# Altium project MicroCO2Sensor.PrjPcb
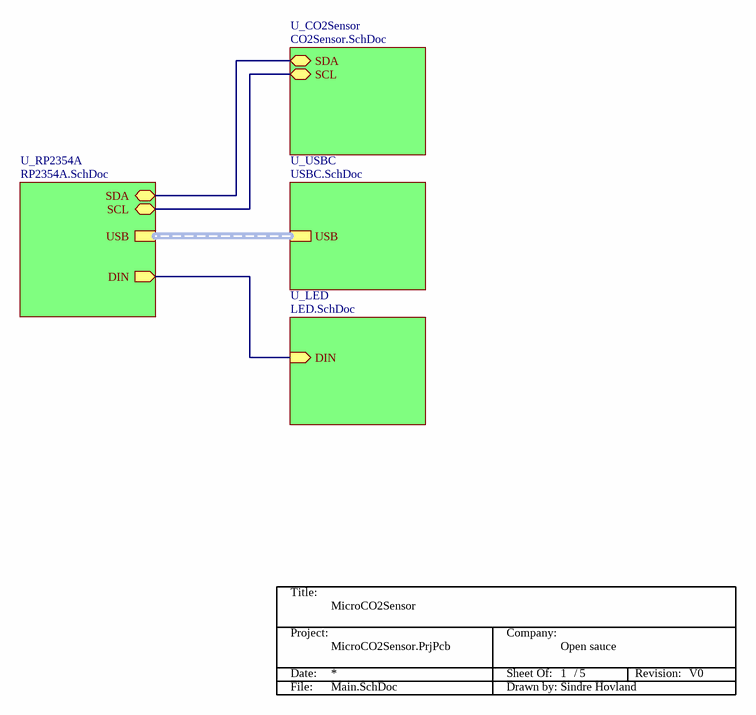
[diagram p0: Main.SchDoc]
5 sheets, 50 parts. Net scope: hierarchical (ports join the sheet entries above them; power ports are global).
Board file: PCB.PcbDoc
Sheets:
  Main.SchDoc
    U_CO2Sensor = CO2Sensor.SchDoc
    U_USBC = USBC.SchDoc
    U_LED = LED.SchDoc
    U_RP2354A = RP2354A.SchDoc

## Sheet Main.SchDoc: MicroCO2Sensor
size A; DrawnBy: Sindre Hovland; Organization: Open sauce; Revision: V0; SheetNumber: 1; SheetTotal: 5

### Parts
*  TitleBlock  (value not drawn)  (graphical)

### Sub-sheets
U_CO2Sensor = CO2Sensor.SchDoc: SDA (bidir), SCL (bidir)
U_LED = LED.SchDoc: DIN (in)
U_RP2354A = RP2354A.SchDoc: USB, DIN (out), SCL (bidir), SDA (bidir)
U_USBC = USBC.SchDoc: USB (harness USB)

### Nets
NetR2_1: sheet U_CO2Sensor/SCL, sheet U_RP2354A/SCL
NetR4_1: sheet U_CO2Sensor/SDA, sheet U_RP2354A/SDA
NetR6_2: sheet U_LED/DIN, sheet U_RP2354A/DIN

### Buses and harness runs
harness sheet U_RP2354A/USB = sheet U_USBC/USB

### Notes on the sheet
- (in symbol TitleBlock) Title:; Project:; Company:; Date:; Sheet Of:; /; Revision:; File:; Drawn by:

## Sheet CO2Sensor.SchDoc: CO2 Sensor
size A; DrawnBy: Sindre Hovland; Organization: Open sauce; Revision: V0; SheetNumber: 2; SheetTotal: 5
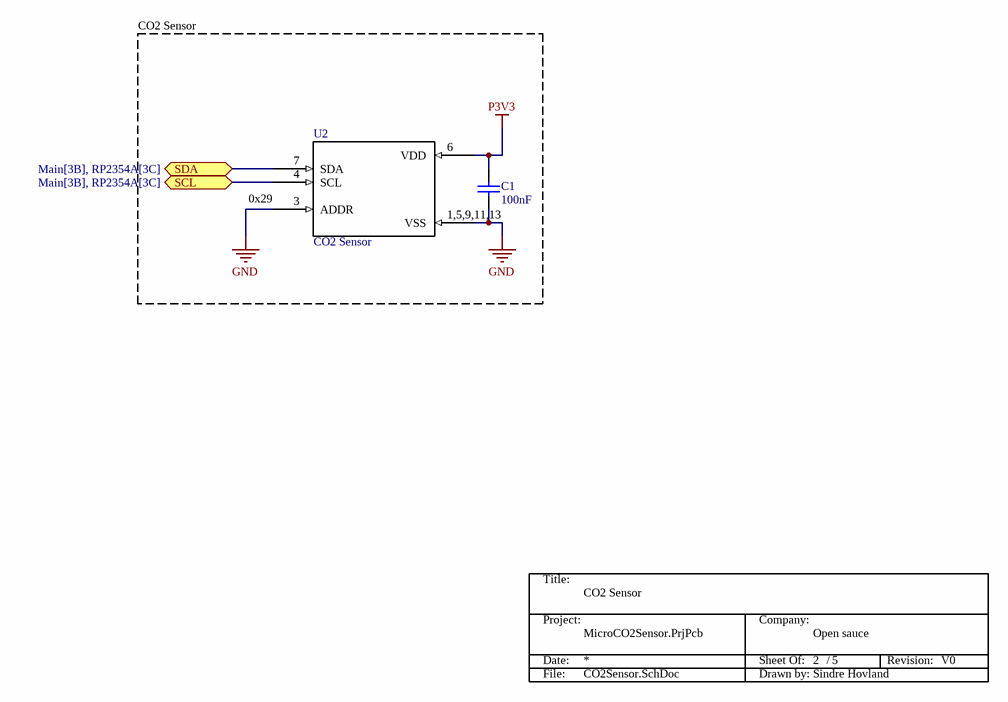
[diagram p1: CO2Sensor.SchDoc]

### Parts
(Parts that share a designator on the sheet are numbered #1, #2 ... from top to bottom, then left to right.)
*?#1  TitleBlock  (value not drawn)  (graphical)
C1  100nF  [C0201]
U2  CO2 Sensor  [STC31-C]

### Ports
SCL (bidir, see Main[3B], RP2354A[3C]), SDA (bidir, see Main[3B], RP2354A[3C])

### Nets
GND: C1.1 U2.1,5,9,11,13(VSS) U2.3(ADDR)
P3V3: C1.2 U2.6(VDD)
NetR2_1: U2.4(SCL) ; port SCL
NetR4_1: U2.7(SDA) ; port SDA

### Notes on the sheet
- CO2 Sensor
- (near U2) 0x29
- (in symbol TitleBlock) Title:; Project:; Company:; Date:; Sheet Of:; /; Revision:; File:; Drawn by:

### Library data of the parts
C1 = CAP: Capacitor; Value: 100pF; Published: 8-Jun-2000; Revision: July-2002: Re-released for DXP Platform.; Publisher: Altium Limited
U2 = STC31-C: CO₂ accuracy of ±(0.2 - 2.0 vol%) @0-100 vol%

## Sheet USBC.SchDoc: USBC/Power
size A; DrawnBy: Sindre Hovland; Organization: Open sauce; Revision: V0; SheetNumber: 3; SheetTotal: 5
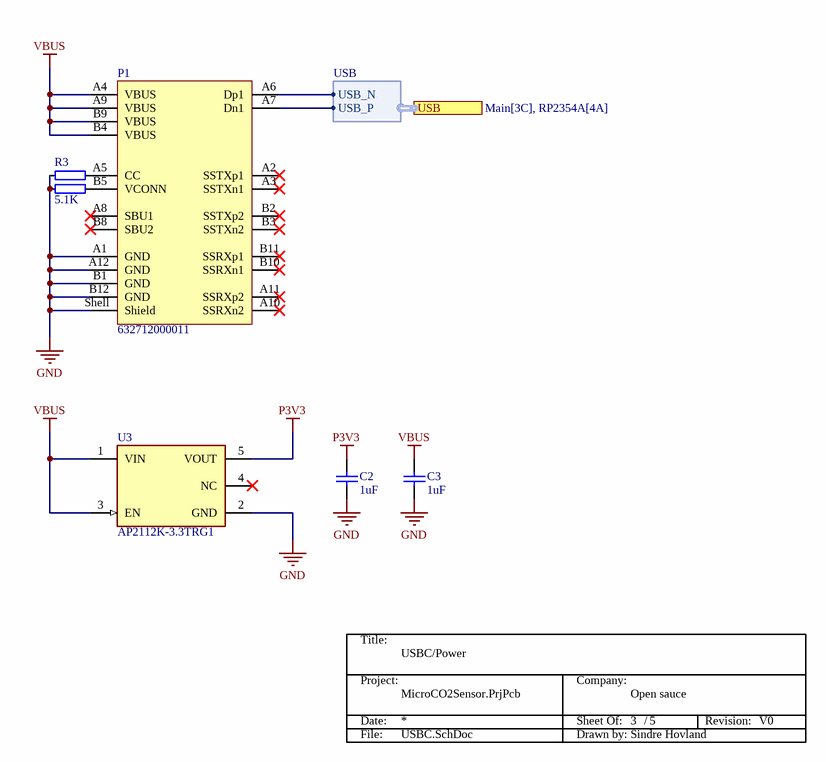
[diagram p2: USBC.SchDoc]

### Parts
(Parts that share a designator on the sheet are numbered #1, #2 ... from top to bottom, then left to right.)
*?#2  TitleBlock  (value not drawn)  (graphical)
C2  1uF  [C0402]
C3  1uF  [C0402]
P1  632712000011  [632712000011]
R3  5.1K  [R0201]  (value not drawn)
R7  5.1K  [R0201]
U3  AP2112K-3.3TRG1  [FP-SOT25-IPC_C]

### Ports
USB (harness USB, see Main[3C], RP2354A[4A])

### Harnesses
USB: USB_N, USB_P

### Nets
GND: C2.1 C3.1 P1.A1(GND) P1.A12(GND) P1.B1(GND) P1.B12(GND) P1.Shell(Shield) R3.2 R7.2 U3.2(GND)
P3V3: C2.2 U3.5(VOUT)
VBUS: C3.2 P1.A4(VBUS) P1.A9(VBUS) P1.B4(VBUS) P1.B9(VBUS) U3.1(VIN) U3.3(EN)
USB_N: P1.A6(Dp1) ; port USB.USB_N
USB_P: P1.A7(Dn1) ; port USB.USB_P
NetP1_A5: P1.A5(CC) R3.1
NetP1_B5: P1.B5(VCONN) R7.1

Not connected (* = marked no-connect by the designer): P1 A2(SSTXp1)* A3(SSTXn1)* A8(SBU1)* A10(SSRXn2)* A11(SSRXp2)* B2(SSTXp2)* B3(SSTXn2)* B8(SBU2)* B10(SSRXn1)* B11(SSRXp1)*; U3 4(NC)*

### Notes on the sheet
- (in symbol TitleBlock) Title:; Project:; Company:; Date:; Sheet Of:; /; Revision:; File:; Drawn by:

### Library data of the parts
C2 C3 = CAP: Capacitor; Value: 100pF; Published: 8-Jun-2000; Revision: July-2002: Re-released for DXP Platform.; Publisher: Altium Limited
P1 = CMP-1502-03215-3: NexarPartId: 68112673; Voltage Rating: 20V; Connector Type: USB; Contact Resistance: 30mΩ; USB Standard: USB 3.1; Number of Contacts: 22; Insulation Resistance: 1GΩ; Current Rating: 5A; Number of Pins: 22; Orientation: Horizontal; Height: 1.9mm; RoHS: Compliant; Contact Material: Gold, Nickel; Min Operating Temperature: -25°C; Packaging: Tape and Reel; Mount: Horizontal, Surface Mount; Max Operating Temperature: 105°C
R3 R7 = RES: Resistor, Generic; Part Number: R0201-0R; Part number IPS: 00000003245; Value: 0R; Note: Chip Res 5%; Artikkelnr Noca: N.A.; Manufacturer: *; Manufacturer Part Number: *; ComponentLink1URL: *; ComponentLink1Description: Datasheet; ComponentLink2URL: *; ComponentLink2Description: Supplier link; HelpURL: *; Footprint Doc: 0201; LatestRevisionDate: 2017-11-09; Pin Count: 2; Publisher: Nordic Semiconductor; Published: 2014-11-13; Supplier 1: *; Supplier Part Number 1: *; Supplier 2: *; Supplier Part Number 2: *
U3 = CMP-12756-000035-1: IC REG LINEAR 3.3V 600MA SOT25; Number of Regulators: 1; Output Type: Fixed; Polarity: Positive; Min Input Voltage: 2.5V; Max Input Voltage: 6V; Accuracy: 1.5%; Quiescent Current: 55uA; Dropout Voltage: 250mV; Min Operating Temperature: -40°C; Length: 3.1mm; Output Current: 600mA; Max Operating Temperature: 85°C; Package Quantity: 1; Output Voltage: 3.3V; Width: 1.7mm; Number of Outputs: 1; Packaging: Tape and Reel; Height: 1.3mm; Lead Free: Lead Free; Max Output Current: 600mA; Case/Package: SOT-23-5; Mount: Surface Mount; Number of Pins: 5

## Sheet LED.SchDoc: Neopixel
size A; DrawnBy: Sindre Hovland; Organization: Open sauce; Revision: V0; SheetNumber: 5; SheetTotal: 5
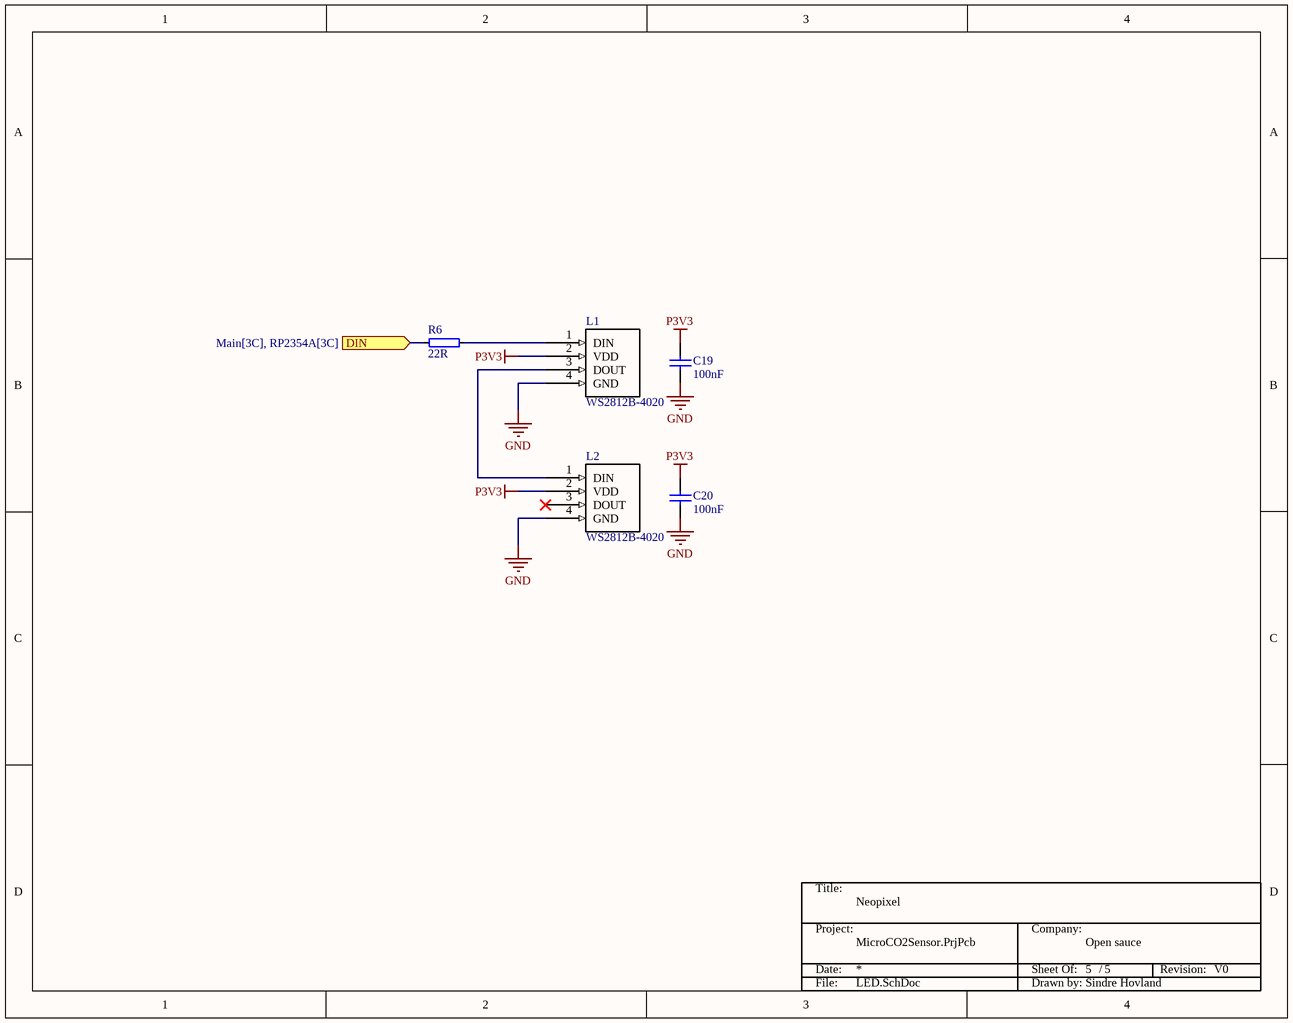
[diagram p3: LED.SchDoc]

### Parts
(Parts that share a designator on the sheet are numbered #1, #2 ... from top to bottom, then left to right.)
*?#3  TitleBlock  (value not drawn)  (graphical)
C19  100nF  [C0201]
C20  100nF  [C0201]
L1  WS2812B-4020  [WS2812B-4020-Footprint-1]
L2  WS2812B-4020  [WS2812B-4020-Footprint-1]
R6  22R  [R0201]

### Ports
DIN (in, see Main[3C], RP2354A[3C])

### Nets
GND: C19.1 C20.1 L1.4(GND) L2.4(GND)
P3V3: C19.2 C20.2 L1.2(VDD) L2.2(VDD)
NetL1_1: L1.1(DIN) R6.1
NetL1_3: L1.3(DOUT) L2.1(DIN)
NetR6_2: R6.2 ; port DIN

Not connected (* = marked no-connect by the designer): L2 3(DOUT)*

### Notes on the sheet
- (in symbol TitleBlock) Title:; Project:; Company:; Date:; Sheet Of:; /; Revision:; File:; Drawn by:

### Library data of the parts
C19 C20 = CAP: Capacitor; Value: 100pF; Published: 8-Jun-2000; Revision: July-2002: Re-released for DXP Platform.; Publisher: Altium Limited
L1 L2 = WS2812B-4020: WS2812B based adressable led 90 deg 0402 mini; ComponentLink2URL: https://datasheet.lcsc.com/lcsc/2012110135_Worldsemi-WS2812B-4020_C965557.pdf; ComponentLink2Description: Datasheet; MPN: WS2812B-4020; ComponentLink1Description: China; ComponentLink1URL: https://www.youtube.com/watch?v=W8x4m-qpmJ8
R6 = RES: as R3 on sheet USBC; Manufacturer: *; Manufacturer Part Number: *; ComponentLink1URL: *; ComponentLink1Description: Datasheet; ComponentLink2URL: *; ComponentLink2Description: Supplier link; HelpURL: *; Footprint Doc: 0201; LatestRevisionDate: 2017-11-09; Pin Count: 2; Publisher: Nordic Semiconductor; Published: 2014-11-13; Supplier 1: *; Supplier Part Number 1: *; Supplier 2: *; Supplier Part Number 2: *

## Sheet RP2354A.SchDoc: MCU
size A; DrawnBy: Sindre Hovland; Organization: Open sauce; Revision: V0; SheetNumber: 4; SheetTotal: 5
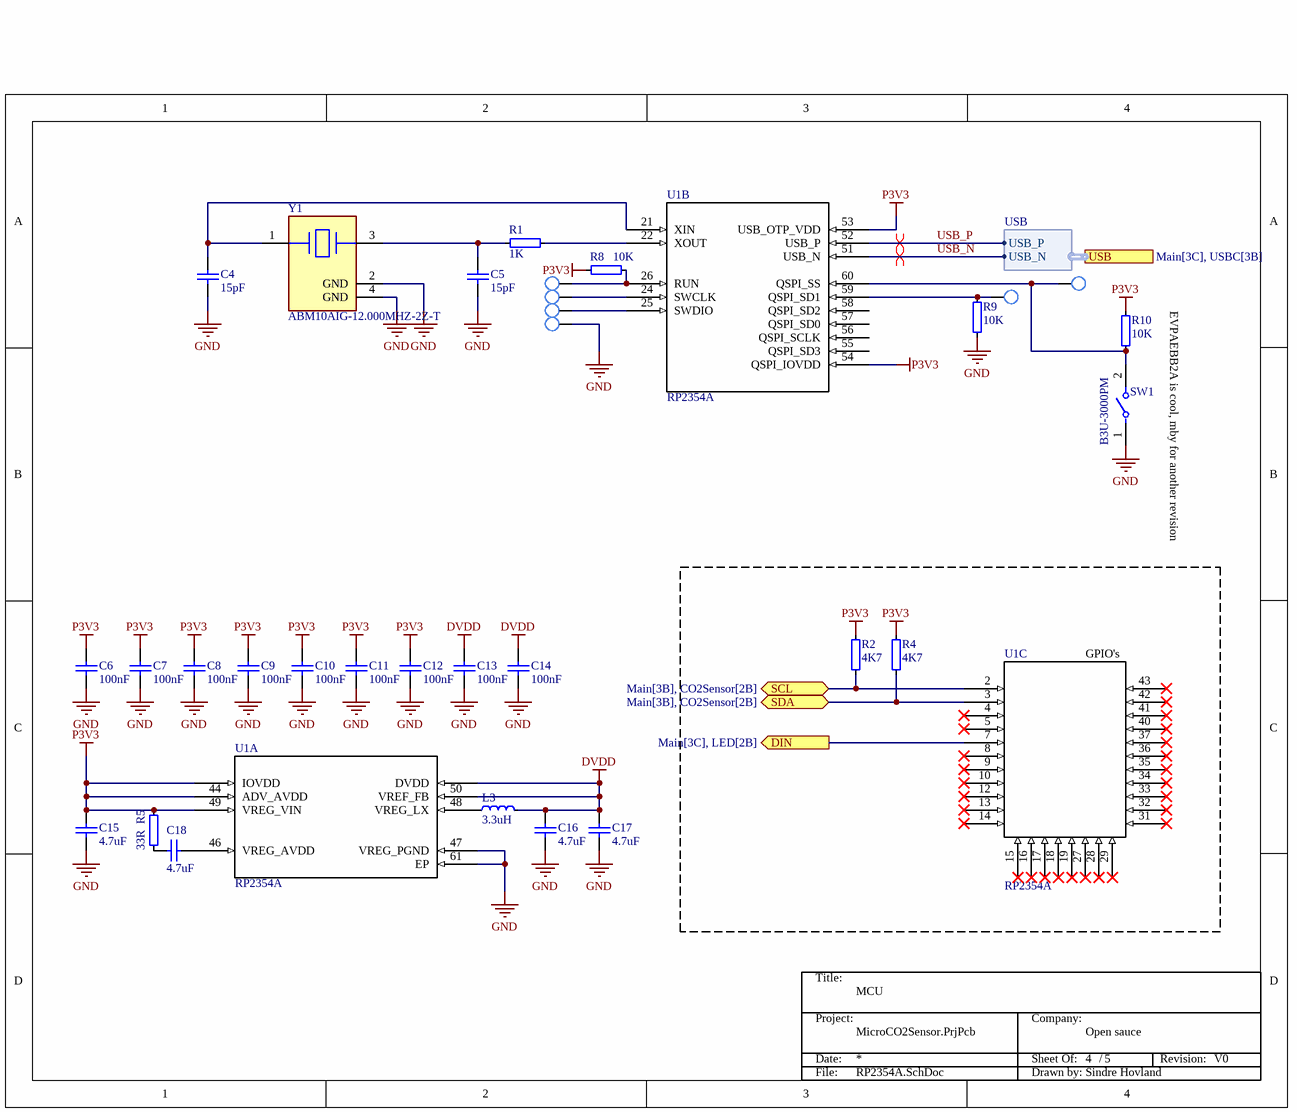
[diagram p4: RP2354A.SchDoc]

### Parts
(Parts that share a designator on the sheet are numbered #1, #2 ... from top to bottom, then left to right.)
*?#4  TitleBlock  (value not drawn)  (graphical)
C4  15pF  [C0201]
C5  15pF  [C0201]
C6  100nF  [C0201]
C7  100nF  [C0201]
C8  100nF  [C0201]
C9  100nF  [C0201]
C10  100nF  [C0201]
C11  100nF  [C0201]
C12  100nF  [C0201]
C13  100nF  [C0201]
C14  100nF  [C0201]
C15  4.7uF  [C0402]
C16  4.7uF  [C0402]
C17  4.7uF  [C0402]
C18  4.7uF  [C0402]
GND  DNP  [TP_SMD_1.0mm]  (value not drawn)
L3  3.3uH  [IND0805]
R1  1K  [R0201]
R2  4K7  [R0201]
R4  4K7  [R0201]
R5  33R  [RES0402]
R8  10K  [R0201]
R9  10K  [R0201]
R10  10K  [R0201]
RUN  DNP  [TP_SMD_1.0mm]  (value not drawn)
SD1  DNP  [TP_SMD_1.0mm]  (value not drawn)
SS  DNP  [TP_SMD_1.0mm]  (value not drawn)
SW1  B3U-3000PM  [FP-B3U-3000PM-MFG]
SWCLK  DNP  [TP_SMD_1.0mm]  (value not drawn)
SWDIO  DNP  [TP_SMD_1.0mm]  (value not drawn)
U1  RP2354A  [RP2354A]  (parts A,B,C of 3)
Y1  ABM10AIG-12.000MHZ-2Z-T  [FP-ABM10AIG-MFG]

### Ports
DIN (out, see Main[3C], LED[2B]), SCL (bidir, see Main[3B], CO2Sensor[2B]), SDA (bidir, see Main[3B], CO2Sensor[2B]), USB (harness USB, see Main[3C], USBC[3B])

### Harnesses
USB: USB_N, USB_P

### Nets
DVDD: C13.1 C14.1 C16.2 C17.2 L3.2 U1.6,23,39(DVDD) U1.50(VREF_FB)
GND: C4.2 C5.1 C6.2 C7.2 C8.2 C9.2 C10.2 C11.2 C12.2 C13.2 C14.2 C15.1 C16.1 C17.1 GND.1 R9.2 SW1.1 U1.47(VREG_PGND) U1.61(EP) Y1.2(GND) Y1.4(GND)
P3V3: C6.1 C7.1 C8.1 C9.1 C10.1 C11.1 C12.1 C15.2 R2.2 R4.2 R5.2 R8.1 R10.1 U1.1,11,30,38,45,20(IOVDD) U1.44(ADV_AVDD) U1.49(VREG_VIN) U1.53(USB_OTP_VDD) U1.54(QSPI_IOVDD)
USB_N: U1.51(USB_N) ; port USB.USB_N
USB_P: U1.52(USB_P) ; port USB.USB_P
NetC4_1: C4.1 U1.21(XIN) Y1.1(1_Crystal)
NetC5_2: C5.2 R1.2 Y1.3(2_Crystal)
NetC18_1: C18.1 R5.1
NetC18_2: C18.2 U1.46(VREG_AVDD)
NetL3_1: L3.1 U1.48(VREG_LX)
NetR1_1: R1.1 U1.22(XOUT)
NetR2_1: R2.1 U1.2 ; port SCL
NetR4_1: R4.1 U1.3 ; port SDA
NetR6_2: U1.7 ; port DIN
NetR8_2: R8.2 RUN.1 U1.26(RUN)
NetR9_1: R9.1 SD1.1 U1.59(QSPI_SD1)
NetR10_2: R10.2 SS.1 SW1.2 U1.60(QSPI_SS)
NetSWCLK_1: SWCLK.1 U1.24(SWCLK)
NetSWDIO_1: SWDIO.1 U1.25(SWDIO)

Not connected (* = marked no-connect by the designer): U1 4* 5* 8* 9* 10* 12* 13* 14* 15* 16* 17* 18* 19* 27* 28* 29* 31* 32* 33* 34* 35* 36* 37* 40* 41* 42* 43* 55(QSPI_SD3) 56(QSPI_SCLK) 57(QSPI_SD0) 58(QSPI_SD2)

### Layout directives
differential pair: USB_N, USB_P

### Notes on the sheet
- EVPAEBB2A is cool, mby for another revision
- (in symbol RP2354A, part C) GPIO's
- (in symbol TitleBlock) Title:; Project:; Company:; Date:; Sheet Of:; /; Revision:; File:; Drawn by:

### Library data of the parts
C4-C18 = CAP: Capacitor; Value: 100pF; Published: 8-Jun-2000; Revision: July-2002: Re-released for DXP Platform.; Publisher: Altium Limited
GND RUN SD1 SS SWCLK SWDIO = TP
L3 = IND: Inductor; Part Number: FB0402-120R@100M-500mA; Manufacturer: Murata; Manufacturer Part Number: BLM15AG121SN1D; Part number IPS: N.A.; Value: 120R/0.55A; Note: Chip EMIFIL Inductor Type Chip Ferrite Bead; Artikkelnr Noca: 33029317; Footprint Doc: 0402; LatestRevisionDate: 2014-01-10; Pin Count: 2; Publisher: Nordic Semiconductor; Published: 2011-11-14; ComponentLink1URL: *; ComponentLink1Description: Datasheet; ComponentLink2URL: *; ComponentLink2Description: Supplier link; HelpURL: http://search.murata.co.jp/Ceramy/image/img/PDF/ENG/L0110S0100BLM15A_SN.pdf
R1 R2 R4 R5 R8-R10 = RES: as R3 on sheet USBC; Manufacturer: *; Manufacturer Part Number: *; ComponentLink1URL: *; ComponentLink1Description: Datasheet; ComponentLink2URL: *; ComponentLink2Description: Supplier link; HelpURL: *; Footprint Doc: 0201; LatestRevisionDate: 2017-11-09; Pin Count: 2; Publisher: Nordic Semiconductor; Published: 2014-11-13; Supplier 1: *; Supplier Part Number 1: *; Supplier 2: *; Supplier Part Number 2: *
SW1 = CMP-08834-000057-1: SWITCH TACTILE SPST-NO 0.05A 12V; Connector Type: SMD/SMT; Switch Travel: 0.2mm; Throw Configuration: SPST; Illumination Type: Non-Illuminated; Mechanical Life: 100000Cycles; Actuator Length: 0.7mm; Switch Function: Off-Mom; Ratings: Dust Proof; Operating Force: 1.59N; Max Current Rating: 50mA; Contact Resistance: 100mR; Termination: Gull Wing; Packaging: Tape and Reel; Case/Package: SMD/SMT; Orientation: Right Angle; Package Quantity: 1000; Mount: Surface Mount; Series: B3U; Max Voltage Rating (DC): 12V; Depth: 3.2mm; Max Operating Temperature: 70°C; RoHS Compliant: Yes; Weight: 0.022g; Min Operating Temperature: -25°C; Electrical Life: 100000Cycles; Current Rating: 50mA; Length: 4mm; Voltage Rating (DC): 12V
U1 = RP2354A: RP2354A: 30 GPIO, 7x7 QFN60, 2MB stacked flash
Y1 = CMP-27762-010436-1: CRYSTAL 12.0000MHZ 10PF SMD

## Nets that join several sheets
GND: CO2Sensor (C1.1 U2.1,5,9,11,13 U2.3), USBC (10 pins), LED (C19.1 C20.1 L1.4 L2.4), RP2354A (21 pins)
P3V3: CO2Sensor (C1.2 U2.6), USBC (C2.2 U3.5), LED (C19.2 C20.2 L1.2 L2.2), RP2354A (18 pins)
NetR2_1: CO2Sensor (U2.4), RP2354A (R2.1 U1.2)
NetR4_1: CO2Sensor (U2.7), RP2354A (R4.1 U1.3)
NetR6_2: LED (R6.2), RP2354A (U1.7)
USB_N: USBC (P1.A6), RP2354A (U1.51)
USB_P: USBC (P1.A7), RP2354A (U1.52)

## Assembly variants
Default: all parts fitted